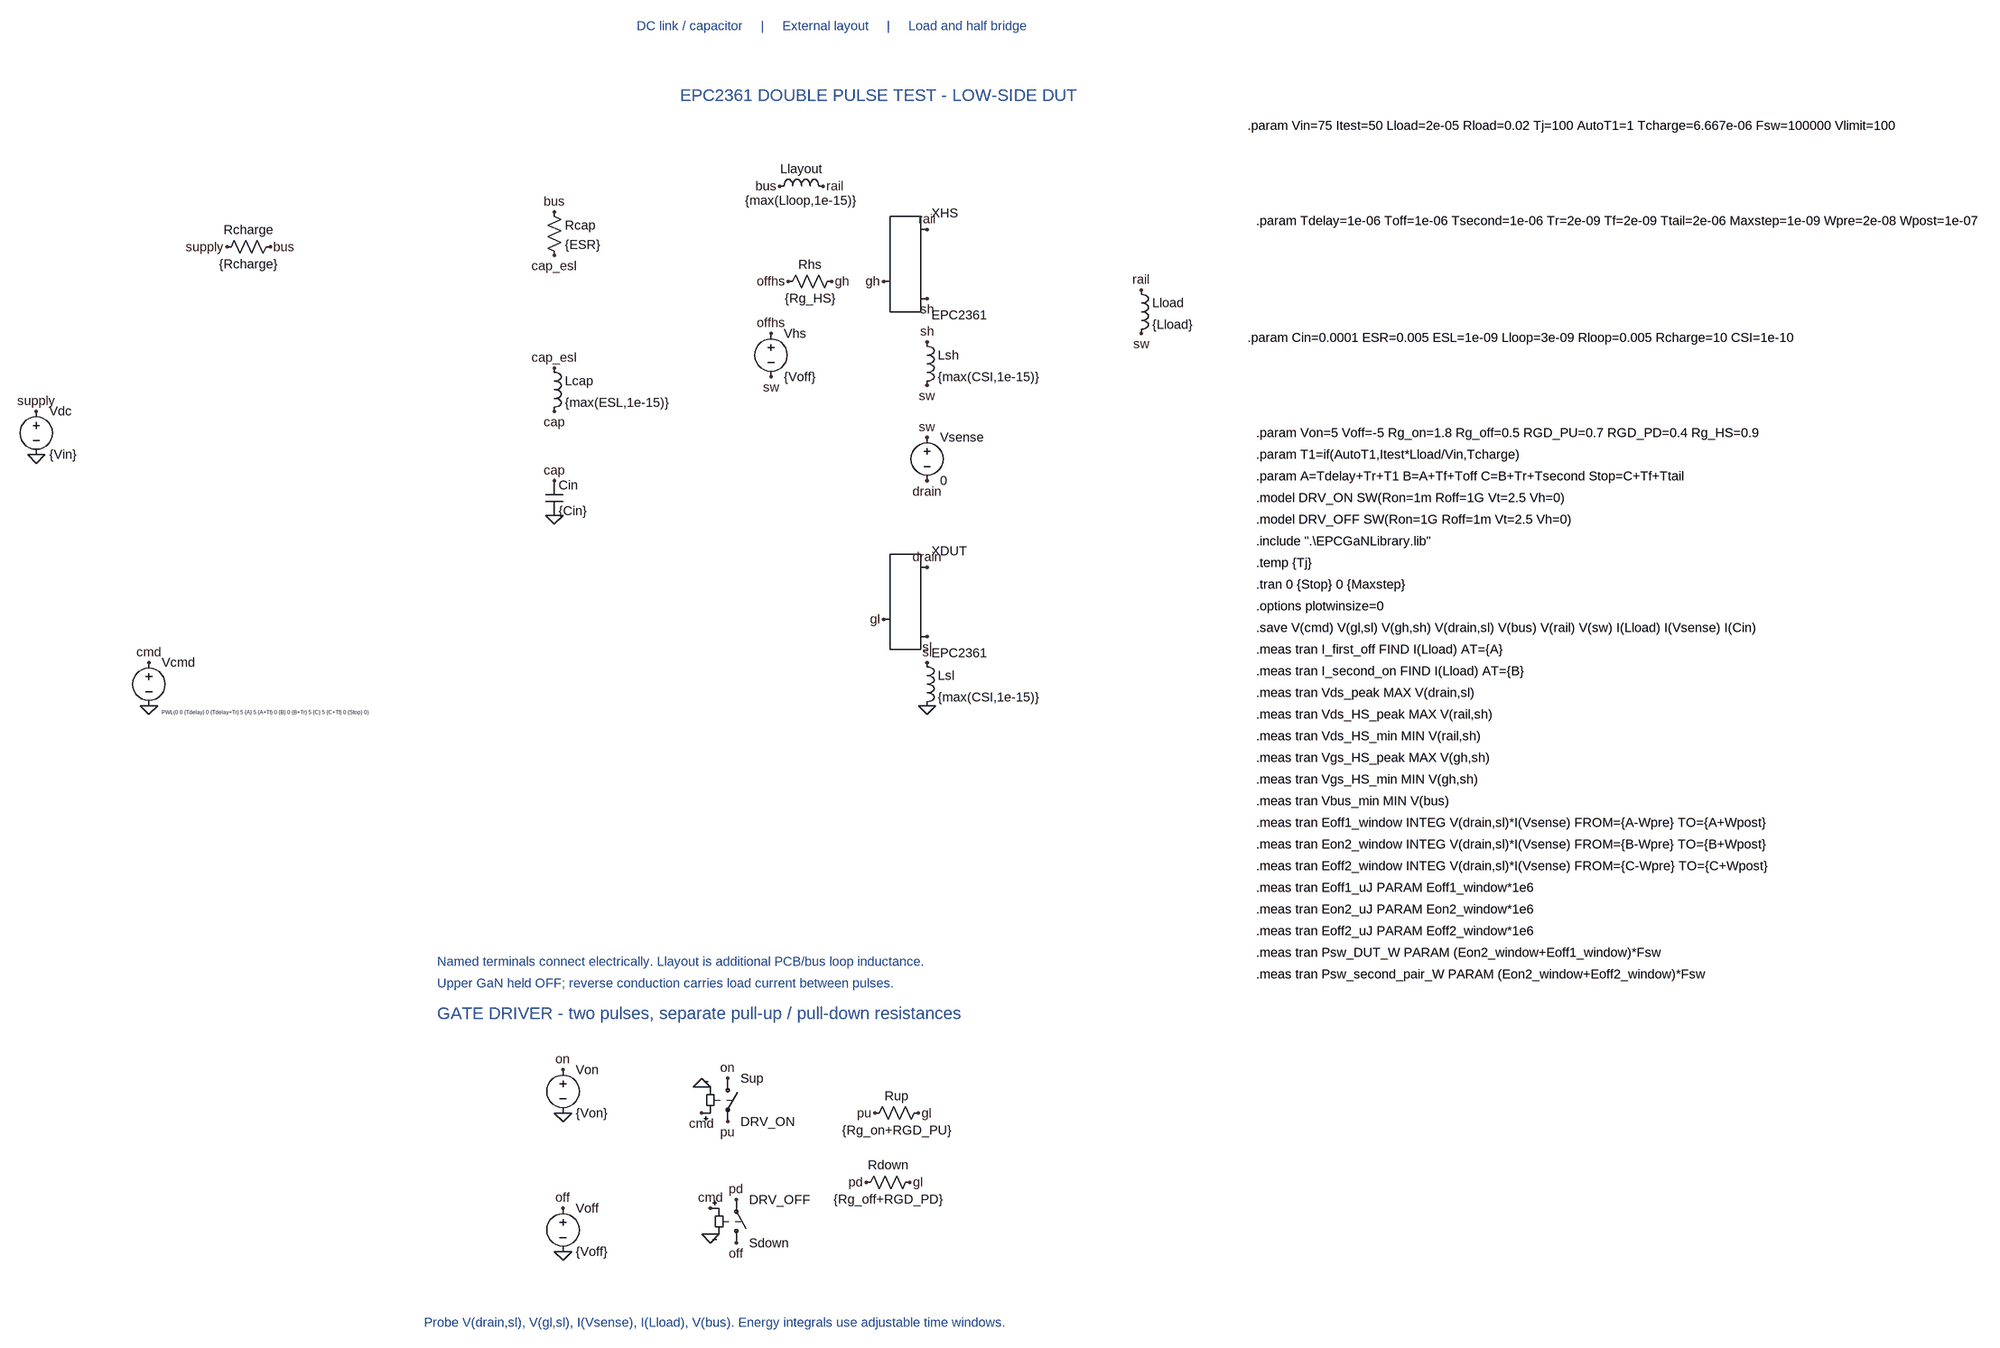
[diagram p0: schematic DPT-EPC-edited_myversion.asc]
DPT-EPC-edited_myversion.asc, the LTspice schematic file:
Version 4
SHEET 1 3264 1840
FLAG -800 112 supply
FLAG -800 192 0
FLAG -448 -192 supply
FLAG -368 -192 bus
FLAG 208 -256 bus
FLAG 208 -176 cap_esl
FLAG 208 32 cap_esl
FLAG 208 112 cap
FLAG 208 240 cap
FLAG 208 304 0
FLAG 624 -304 bus
FLAG 704 -304 rail
FLAG 1360 -112 rail
FLAG 1360 -32 sw
FLAG 816 -128 gh
FLAG 896 -224 rail
FLAG 896 -96 sh
FLAG 896 -16 sh
FLAG 896 64 sw
FLAG 896 160 sw
FLAG 896 240 drain
FLAG 816 496 gl
FLAG 896 400 drain
FLAG 896 528 sl
FLAG 896 576 sl
FLAG 896 656 0
FLAG 608 -32 offhs
FLAG 608 48 sw
FLAG 640 -128 offhs
FLAG 720 -128 gh
FLAG -592 576 cmd
FLAG -592 656 0
FLAG 224 1328 on
FLAG 224 1408 0
FLAG 224 1584 off
FLAG 224 1664 0
FLAG 528 1344 on
FLAG 528 1424 pu
FLAG 480 1408 cmd
FLAG 480 1360 0
FLAG 800 1408 pu
FLAG 880 1408 gl
FLAG 544 1648 off
FLAG 544 1568 pd
FLAG 496 1584 cmd
FLAG 496 1632 0
FLAG 784 1536 pd
FLAG 864 1536 gl
SYMBOL voltage -800 96 R0
SYMATTR InstName Vdc
SYMATTR Value {Vin}
SYMBOL res -464 -176 R270
WINDOW 0 32 56 VTop 2
WINDOW 3 0 56 VBottom 2
SYMATTR InstName Rcharge
SYMATTR Value {Rcharge}
SYMBOL res 192 -272 R0
SYMATTR InstName Rcap
SYMATTR Value {ESR}
SYMBOL ind 192 16 R0
SYMATTR InstName Lcap
SYMATTR Value {max(ESL,1e-15)}
SYMATTR SpiceLine Rser=0
SYMBOL cap 192 240 R0
SYMATTR InstName Cin
SYMATTR Value {Cin}
SYMBOL ind 608 -288 R270
WINDOW 0 32 56 VTop 2
WINDOW 3 5 56 VBottom 2
SYMATTR InstName Llayout
SYMATTR Value {max(Lloop,1e-15)}
SYMATTR SpiceLine Rser={Rloop}
SYMBOL ind 1344 -128 R0
SYMATTR InstName Lload
SYMATTR Value {Lload}
SYMATTR SpiceLine Rser={Rload}
SYMBOL EPCGaN 816 -128 R0
SYMATTR InstName XHS
SYMATTR Value EPC2361
SYMATTR ModelFile .\EPCGaNLibrary.lib
SYMBOL ind 880 -32 R0
SYMATTR InstName Lsh
SYMATTR Value {max(CSI,1e-15)}
SYMATTR SpiceLine Rser=0
SYMBOL voltage 896 144 R0
SYMATTR InstName Vsense
SYMATTR Value 0
SYMBOL EPCGaN 816 496 R0
SYMATTR InstName XDUT
SYMATTR Value EPC2361
SYMATTR ModelFile .\EPCGaNLibrary.lib
SYMBOL ind 880 560 R0
SYMATTR InstName Lsl
SYMATTR Value {max(CSI,1e-15)}
SYMATTR SpiceLine Rser=0
SYMBOL voltage 608 -48 R0
SYMATTR InstName Vhs
SYMATTR Value {Voff}
SYMBOL res 624 -112 R270
WINDOW 0 32 56 VTop 2
WINDOW 3 0 56 VBottom 2
SYMATTR InstName Rhs
SYMATTR Value {Rg_HS}
SYMBOL voltage -592 560 R0
WINDOW 3 24 108 Left 0
SYMATTR Value PWL(0 0 {Tdelay} 0 {Tdelay+Tr} 5 {A} 5 {A+Tf} 0 {B} 0 {B+Tr} 5 {C} 5 {C+Tf} 0 {Stop} 0)
SYMATTR InstName Vcmd
SYMBOL voltage 224 1312 R0
SYMATTR InstName Von
SYMATTR Value {Von}
SYMBOL voltage 224 1568 R0
SYMATTR InstName Voff
SYMATTR Value {Voff}
SYMBOL sw 528 1328 R0
SYMATTR InstName Sup
SYMATTR Value DRV_ON
SYMBOL res 784 1424 R270
WINDOW 0 32 56 VTop 2
WINDOW 3 0 56 VBottom 2
SYMATTR InstName Rup
SYMATTR Value {Rg_on+RGD_PU}
SYMBOL sw 544 1664 M180
SYMATTR InstName Sdown
SYMATTR Value DRV_OFF
SYMBOL res 768 1552 R270
WINDOW 0 32 56 VTop 2
WINDOW 3 0 56 VBottom 2
SYMATTR InstName Rdown
SYMATTR Value {Rg_off+RGD_PD}
TEXT 440 -472 Left 3 ;EPC2361 DOUBLE PULSE TEST - LOW-SIDE DUT
TEXT 360 -672 Left 2 ;DC link / capacitor     |     External layout     |     Load and half bridge
TEXT -8 1128 Left 2 ;Named terminals connect electrically. Llayout is additional PCB/bus loop inductance.
TEXT -8 1168 Left 2 ;Upper GaN held OFF; reverse conduction carries load current between pulses.
TEXT -8 1224 Left 3 ;GATE DRIVER - two pulses, separate pull-up / pull-down resistances
TEXT -32 1800 Left 2 ;Probe V(drain,sl), V(gl,sl), I(Vsense), I(Lload), V(bus). Energy integrals use adjustable time windows.
TEXT 1776 -416 Left 2 !.param Vin=75 Itest=50 Lload=2e-05 Rload=0.02 Tj=100 AutoT1=1 Tcharge=6.667e-06 Fsw=100000 Vlimit=100
TEXT 1792 -240 Left 2 !.param Tdelay=1e-06 Toff=1e-06 Tsecond=1e-06 Tr=2e-09 Tf=2e-09 Ttail=2e-06 Maxstep=1e-09 Wpre=2e-08 Wpost=1e-07
TEXT 1776 -24 Left 2 !.param Cin=0.0001 ESR=0.005 ESL=1e-09 Lloop=3e-09 Rloop=0.005 Rcharge=10 CSI=1e-10
TEXT 1792 152 Left 2 !.param Von=5 Voff=-5 Rg_on=1.8 Rg_off=0.5 RGD_PU=0.7 RGD_PD=0.4 Rg_HS=0.9
TEXT 1792 192 Left 2 !.param T1=if(AutoT1,Itest*Lload/Vin,Tcharge)
TEXT 1792 232 Left 2 !.param A=Tdelay+Tr+T1 B=A+Tf+Toff C=B+Tr+Tsecond Stop=C+Tf+Ttail
TEXT 1792 272 Left 2 !.model DRV_ON SW(Ron=1m Roff=1G Vt=2.5 Vh=0)
TEXT 1792 312 Left 2 !.model DRV_OFF SW(Ron=1G Roff=1m Vt=2.5 Vh=0)
TEXT 1792 352 Left 2 !.include ".\\EPCGaNLibrary.lib"
TEXT 1792 392 Left 2 !.temp {Tj}
TEXT 1792 432 Left 2 !.tran 0 {Stop} 0 {Maxstep}
TEXT 1792 472 Left 2 !.options plotwinsize=0
TEXT 1792 512 Left 2 !.save V(cmd) V(gl,sl) V(gh,sh) V(drain,sl) V(bus) V(rail) V(sw) I(Lload) I(Vsense) I(Cin)
TEXT 1792 552 Left 2 !.meas tran I_first_off FIND I(Lload) AT={A}
TEXT 1792 592 Left 2 !.meas tran I_second_on FIND I(Lload) AT={B}
TEXT 1792 632 Left 2 !.meas tran Vds_peak MAX V(drain,sl)
TEXT 1792 672 Left 2 !.meas tran Vds_HS_peak MAX V(rail,sh)
TEXT 1792 712 Left 2 !.meas tran Vds_HS_min MIN V(rail,sh)
TEXT 1792 752 Left 2 !.meas tran Vgs_HS_peak MAX V(gh,sh)
TEXT 1792 792 Left 2 !.meas tran Vgs_HS_min MIN V(gh,sh)
TEXT 1792 832 Left 2 !.meas tran Vbus_min MIN V(bus)
TEXT 1792 872 Left 2 !.meas tran Eoff1_window INTEG V(drain,sl)*I(Vsense) FROM={A-Wpre} TO={A+Wpost}
TEXT 1792 912 Left 2 !.meas tran Eon2_window INTEG V(drain,sl)*I(Vsense) FROM={B-Wpre} TO={B+Wpost}
TEXT 1792 952 Left 2 !.meas tran Eoff2_window INTEG V(drain,sl)*I(Vsense) FROM={C-Wpre} TO={C+Wpost}
TEXT 1792 992 Left 2 !.meas tran Eoff1_uJ PARAM Eoff1_window*1e6
TEXT 1792 1032 Left 2 !.meas tran Eon2_uJ PARAM Eon2_window*1e6
TEXT 1792 1072 Left 2 !.meas tran Eoff2_uJ PARAM Eoff2_window*1e6
TEXT 1792 1112 Left 2 !.meas tran Psw_DUT_W PARAM (Eon2_window+Eoff1_window)*Fsw
TEXT 1792 1152 Left 2 !.meas tran Psw_second_pair_W PARAM (Eon2_window+Eoff2_window)*Fsw

The netlist it stands for:
* DPT-EPC-edited_myversion.asc
Vdc supply 0 {Vin}
Rcharge supply bus {Rcharge}
Rcap bus cap_esl {ESR}
Lcap cap_esl cap {max(ESL,1e-15)} Rser=0
Cin cap 0 {Cin}
Llayout bus rail {max(Lloop,1e-15)} Rser={Rloop}
Lload rail sw {Lload} Rser={Rload}
XXHS gh rail sh EPC2361
Lsh sh sw {max(CSI,1e-15)} Rser=0
Vsense sw drain 0
XXDUT gl drain sl EPC2361
Lsl sl 0 {max(CSI,1e-15)} Rser=0
Vhs offhs sw {Voff}
Rhs offhs gh {Rg_HS}
Vcmd cmd 0 PWL(0 0 {Tdelay} 0 {Tdelay+Tr} 5 {A} 5 {A+Tf} 0 {B} 0 {B+Tr} 5 {C} 5 {C+Tf} 0 {Stop} 0)
Von on 0 {Von}
Voff off 0 {Voff}
Sup on pu cmd 0 DRV_ON
Rup pu gl {Rg_on+RGD_PU}
Sdown off pd cmd 0 DRV_OFF
Rdown pd gl {Rg_off+RGD_PD}
* EPC2361 DOUBLE PULSE TEST - LOW-SIDE DUT
* DC link / capacitor     |     External layout     |     Load and half bridge
* Named terminals connect electrically. Llayout is additional PCB/bus loop inductance.
* Upper GaN held OFF; reverse conduction carries load current between pulses.
* GATE DRIVER - two pulses, separate pull-up / pull-down resistances
* Probe V(drain,sl), V(gl,sl), I(Vsense), I(Lload), V(bus). Energy integrals use adjustable time windows.
.param Vin=75 Itest=50 Lload=2e-05 Rload=0.02 Tj=100 AutoT1=1 Tcharge=6.667e-06 Fsw=100000 Vlimit=100
.param Tdelay=1e-06 Toff=1e-06 Tsecond=1e-06 Tr=2e-09 Tf=2e-09 Ttail=2e-06 Maxstep=1e-09 Wpre=2e-08 Wpost=1e-07
.param Cin=0.0001 ESR=0.005 ESL=1e-09 Lloop=3e-09 Rloop=0.005 Rcharge=10 CSI=1e-10
.param Von=5 Voff=-5 Rg_on=1.8 Rg_off=0.5 RGD_PU=0.7 RGD_PD=0.4 Rg_HS=0.9
.param T1=if(AutoT1,Itest*Lload/Vin,Tcharge)
.param A=Tdelay+Tr+T1 B=A+Tf+Toff C=B+Tr+Tsecond Stop=C+Tf+Ttail
.model DRV_ON SW(Ron=1m Roff=1G Vt=2.5 Vh=0)
.model DRV_OFF SW(Ron=1G Roff=1m Vt=2.5 Vh=0)
.include ".\EPCGaNLibrary.lib"
.temp {Tj}
.tran 0 {Stop} 0 {Maxstep}
.options plotwinsize=0
.save V(cmd) V(gl,sl) V(gh,sh) V(drain,sl) V(bus) V(rail) V(sw) I(Lload) I(Vsense) I(Cin)
.meas tran I_first_off FIND I(Lload) AT={A}
.meas tran I_second_on FIND I(Lload) AT={B}
.meas tran Vds_peak MAX V(drain,sl)
.meas tran Vds_HS_peak MAX V(rail,sh)
.meas tran Vds_HS_min MIN V(rail,sh)
.meas tran Vgs_HS_peak MAX V(gh,sh)
.meas tran Vgs_HS_min MIN V(gh,sh)
.meas tran Vbus_min MIN V(bus)
.meas tran Eoff1_window INTEG V(drain,sl)*I(Vsense) FROM={A-Wpre} TO={A+Wpost}
.meas tran Eon2_window INTEG V(drain,sl)*I(Vsense) FROM={B-Wpre} TO={B+Wpost}
.meas tran Eoff2_window INTEG V(drain,sl)*I(Vsense) FROM={C-Wpre} TO={C+Wpost}
.meas tran Eoff1_uJ PARAM Eoff1_window*1e6
.meas tran Eon2_uJ PARAM Eon2_window*1e6
.meas tran Eoff2_uJ PARAM Eoff2_window*1e6
.meas tran Psw_DUT_W PARAM (Eon2_window+Eoff1_window)*Fsw
.meas tran Psw_second_pair_W PARAM (Eon2_window+Eoff2_window)*Fsw
.lib .\EPCGaNLibrary.lib
.backanno
.end